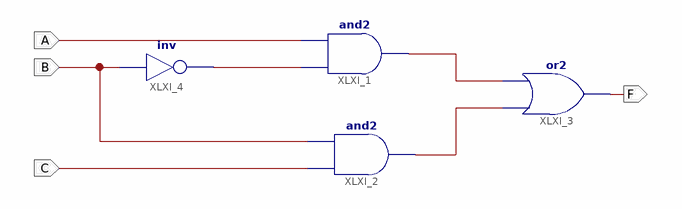
[diagram p0: schematic sheet 1]
// Xilinx ISE schematic simple_logic.sch (spartan6) as structural Verilog: 4 symbols, 4 ports
module simple_logic (
  input  B,
  input  A,
  input  C,
  output F
);

  wire XLXN_1, XLXN_2, XLXN_3;

  and XLXI_1 (XLXN_2, XLXN_1, A);
  and XLXI_2 (XLXN_3, C, B);
  or XLXI_3 (F, XLXN_3, XLXN_2);
  not XLXI_4 (XLXN_1, B);
endmodule
